# Altium schematic sheet BufferOut.SchDoc
size A
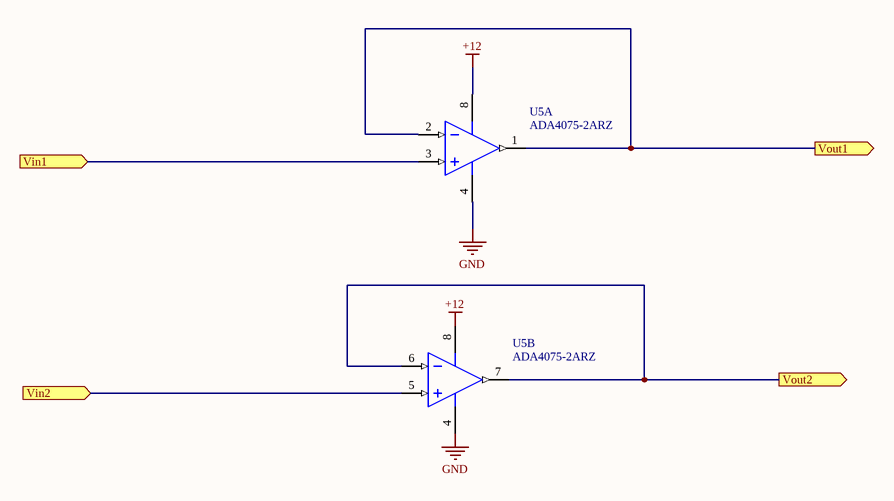
[diagram p0: BufferOut.SchDoc]

## Parts
U5  ADA4075-2ARZ  [ADI-R-8_N]  (parts A,B of 2)

## Ports
Vin1 (in), Vin2 (in), Vout1 (out), Vout2 (out)

## Nets
+12: U5.8(+V)
GND: U5.4(-V)
Vin1: U5.3(+IN_A) ; port Vin1
Vin2: U5.5(+IN_B) ; port Vin2
Vout1: U5.1(OUT_A) U5.2(-IN_A) ; port Vout1
Vout2: U5.6(-IN_B) U5.7(OUT_B) ; port Vout2

## Library data of the parts
U5 = CMP-0384-00855-1: Double Channel Ultra Low Noise Operational Amplifier, 6.5 MHz BW, 12 V/us SR, Industrial, 8-pin SOIC (R-8), Tube; Manufacturer: Analog Devices; V Span Max: 36V; Small Signal Bandwidth: 6.5MHz; Input Bias Current: 30nA; V Span Min: 24V; Amplifiers Per Package: 2; Input Offset Voltage: 300uV; Slew Rate: 12V/us; Iq/Amp: 1.8mA; DatasheetVersion: Rev. B; PackageDescription: 8-Pin Standard Small Outline Package, Body 3.9 x 4.9 mm, Pitch 1.27 mm; Generic Part Number: ADA4075-2; PackageReference: R-8; ComponentLink3URL: http://www.analog.com/static/imported-files/packages/PKG_PDF/SOIC_Narrow%20(R)/R_8.pdf; ComponentLink2URL: http://www.analog.com/static/imported-files/data_sheets/ADA4075-2.pdf; ComponentLink3Description: Package Specification; ComponentLink1Description: Manufacturer URL; PartNumber: ADA4075-2ARZ; PackageVersion: 060506-A; ComponentLink2Description: Datasheet; Code_JEDEC: MS-012-AA; ComponentLink1URL: http://www.analog.com/en/index.html; Mounting Technology: Surface Mount